# Altium schematic sheet FPGA Bank 2.SchDoc
size A4
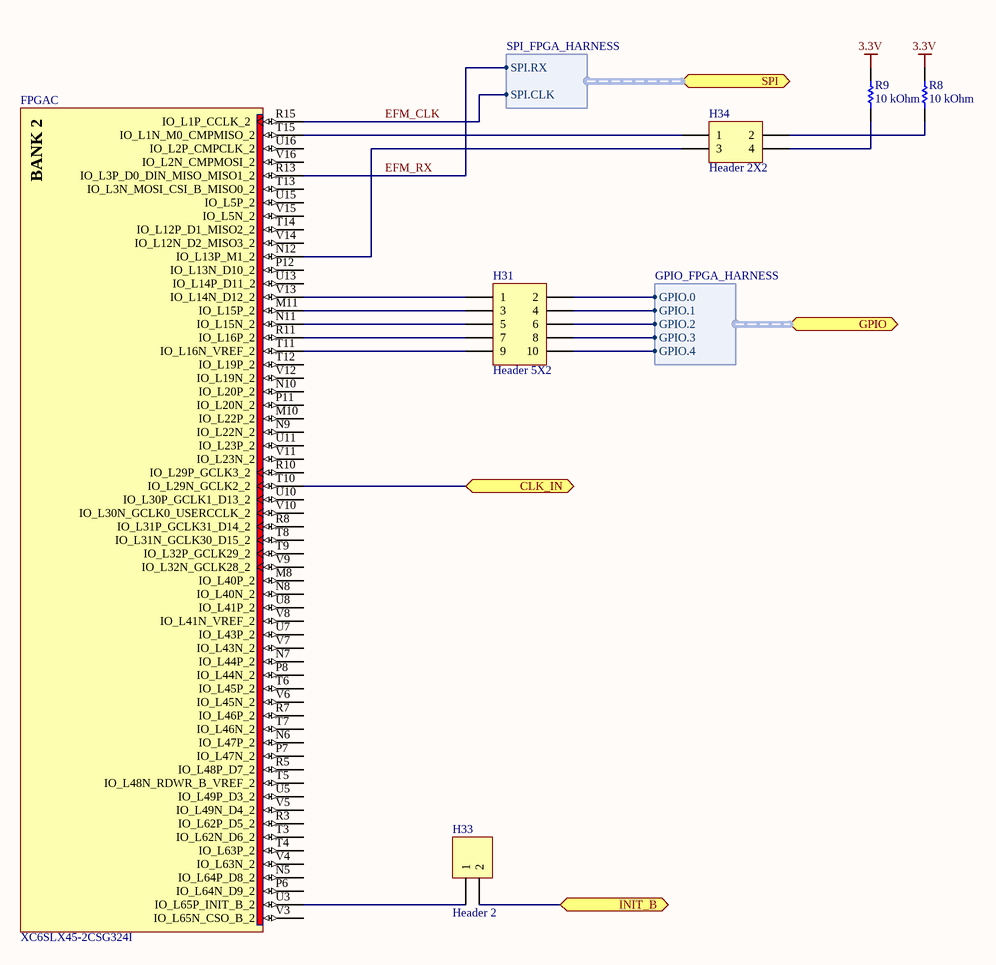
[diagram p0: FPGA Bank 2.SchDoc]

## Parts
FPGA  XC6SLX45-2CSG324I  [CSG324]  (part C of 8)
H31  Header 5X2  [HDR2X5]
H33  Header 2  [HDR1X2]
H34  Header 2X2  [HDR2X2]
R8  10 kOhm  [RESC0603(1608)_M]
R9  10 kOhm  [RESC0603(1608)_M]

## Ports
CLK_IN, GPIO (harness GPIO_FPGA_HARNESS), INIT_B, SPI (harness SPI_FPGA_HARNESS)

## Harnesses
GPIO_FPGA_HARNESS: GPIO.0, GPIO.1, GPIO.2, GPIO.3, GPIO.4
SPI_FPGA_HARNESS: SPI.RX, SPI.CLK

## Nets
3.3V: R8.2 R9.2
CLK_IN: FPGA.T10(IO_L29N_GCLK2_2) ; port CLK_IN
EFM_CLK: FPGA.R15(IO_L1P_CCLK_2) ; port SPI.SPI.CLK
EFM_RX: FPGA.R13(IO_L3P_D0_DIN_MISO_MISO1_2) ; port SPI.SPI.RX
INIT_B: H33.2 ; port INIT_B
NetFPGA_M11: FPGA.M11(IO_L15P_2) H31.3
NetFPGA_N11: FPGA.N11(IO_L15N_2) H31.5
NetFPGA_N12: FPGA.N12(IO_L13P_M1_2) H34.3
NetFPGA_R11: FPGA.R11(IO_L16P_2) H31.7
NetFPGA_T11: FPGA.T11(IO_L16N_VREF_2) H31.9
NetFPGA_T15: FPGA.T15(IO_L1N_M0_CMPMISO_2) H34.1
NetFPGA_U3: FPGA.U3(IO_L65P_INIT_B_2) H33.1
NetFPGA_V13: FPGA.V13(IO_L14N_D12_2) H31.1
NetH31_2: H31.2 ; port GPIO.GPIO.0
NetH31_4: H31.4 ; port GPIO.GPIO.1
NetH31_6: H31.6 ; port GPIO.GPIO.2
NetH31_8: H31.8 ; port GPIO.GPIO.3
NetH31_10: H31.10 ; port GPIO.GPIO.4
NetH34_2: H34.2 R8.1
NetH34_4: H34.4 R9.1

Not connected (* = marked no-connect by the designer): FPGA M8(IO_L40P_2) M10(IO_L22P_2) N5(IO_L64P_D8_2) N6(IO_L47P_2) N7(IO_L44P_2) N8(IO_L40N_2) N9(IO_L22N_2) N10(IO_L20P_2) P6(IO_L64N_D9_2) P7(IO_L47N_2) P8(IO_L44N_2) P11(IO_L20N_2) P12(IO_L13N_D10_2) R3(IO_L62P_D5_2) R5(IO_L48P_D7_2) R7(IO_L46P_2) R8(IO_L31P_GCLK31_D14_2) R10(IO_L29P_GCLK3_2) T3(IO_L62N_D6_2) T4(IO_L63P_2) T5(IO_L48N_RDWR_B_VREF_2) T6(IO_L45P_2) T7(IO_L46N_2) T8(IO_L31N_GCLK30_D15_2) T9(IO_L32P_GCLK29_2) T12(IO_L19P_2) T13(IO_L3N_MOSI_CSI_B_MISO0_2) T14(IO_L12P_D1_MISO2_2) U5(IO_L49P_D3_2) U7(IO_L43P_2) U8(IO_L41P_2) U10(IO_L30P_GCLK1_D13_2) U11(IO_L23P_2) U13(IO_L14P_D11_2) U15(IO_L5P_2) U16(IO_L2P_CMPCLK_2) V3(IO_L65N_CSO_B_2) V4(IO_L63N_2) V5(IO_L49N_D4_2) V6(IO_L45N_2) V7(IO_L43N_2) V8(IO_L41N_VREF_2) V9(IO_L32N_GCLK28_2) V10(IO_L30N_GCLK0_USERCCLK_2) V11(IO_L23N_2) V12(IO_L19N_2) V14(IO_L12N_D2_MISO3_2) V15(IO_L5N_2) V16(IO_L2N_CMPMOSI_2)

## Notes on the sheet
- (in symbol XC6SLX45-2CSG324I, part C) BANK 2

## Library data of the parts
FPGA = XC6SLX45-2CSG324I: Spartan-6 LX 1.2V FPGA, 218 User I/Os, 324-Ball Chip-Scale BGA (0.8mm Pitch), Speed Grade 2, Industrial Grade, Pb-Free; Published: 17-Nov-2009; DatasheetVersion: ver1.6, Nov-2010; PackageVersion: ver1.1, Nov-2009; PackageReference: CSG324; Publisher: Altium Limited; PackageDescription: 324-Ball Chip-Scale BGA (CSG324) Package, 0.8 mm Pitch; Supplier 1: Digi-Key; Supplier Part Number 1: XC6SLX45-2CSG324I-ND; Code_JEDEC: MO-275-KKAC-1; ComponentLink1Description: Manufacturer Link; ComponentLink1URL: http://www.xilinx.com; ComponentLink2Description: Spartan-6 Datasheet; ComponentLink2URL: http://www.xilinx.com/support/documentation/data_sheets/ds160.pdf; ComponentLink3Description: Spartan-6 Documents; ComponentLink3URL: http://www.xilinx.com/support/documentation/spartan-6.htm; ComponentLink4Description: Xilinx.com Home; ComponentLink4URL: http://www.xilinx.com
H31 = Header 5X2: Header, 5-Pin, Dual row; LatestRevisionDate: 17-Jul-2002; LatestRevisionNote: Re-released for DXP Platform.; Publisher: Altium Limited
H33 = Header 2: Header, 2-Pin; LatestRevisionDate: 17-Jul-2002; LatestRevisionNote: Re-released for DXP Platform.; Publisher: Altium Limited
H34 = Header 2X2: Header, 2-Pin, Dual row; LatestRevisionDate: 17-Jul-2002; LatestRevisionNote: Re-released for DXP Platform.; Publisher: Altium Limited
R8 R9 = CMP-1012-00002-1: 1R 0.1W 5% 0603 (1608 Metric)  SMD; Case-Metric: 1608; Case-EIA: 0603; Power: 0.1 W; Technology: SMT; Value: 10 kOhm; Tolerance: 5 %